# Altium schematic sheet 10  - Latching Delay.SchDoc
size A4
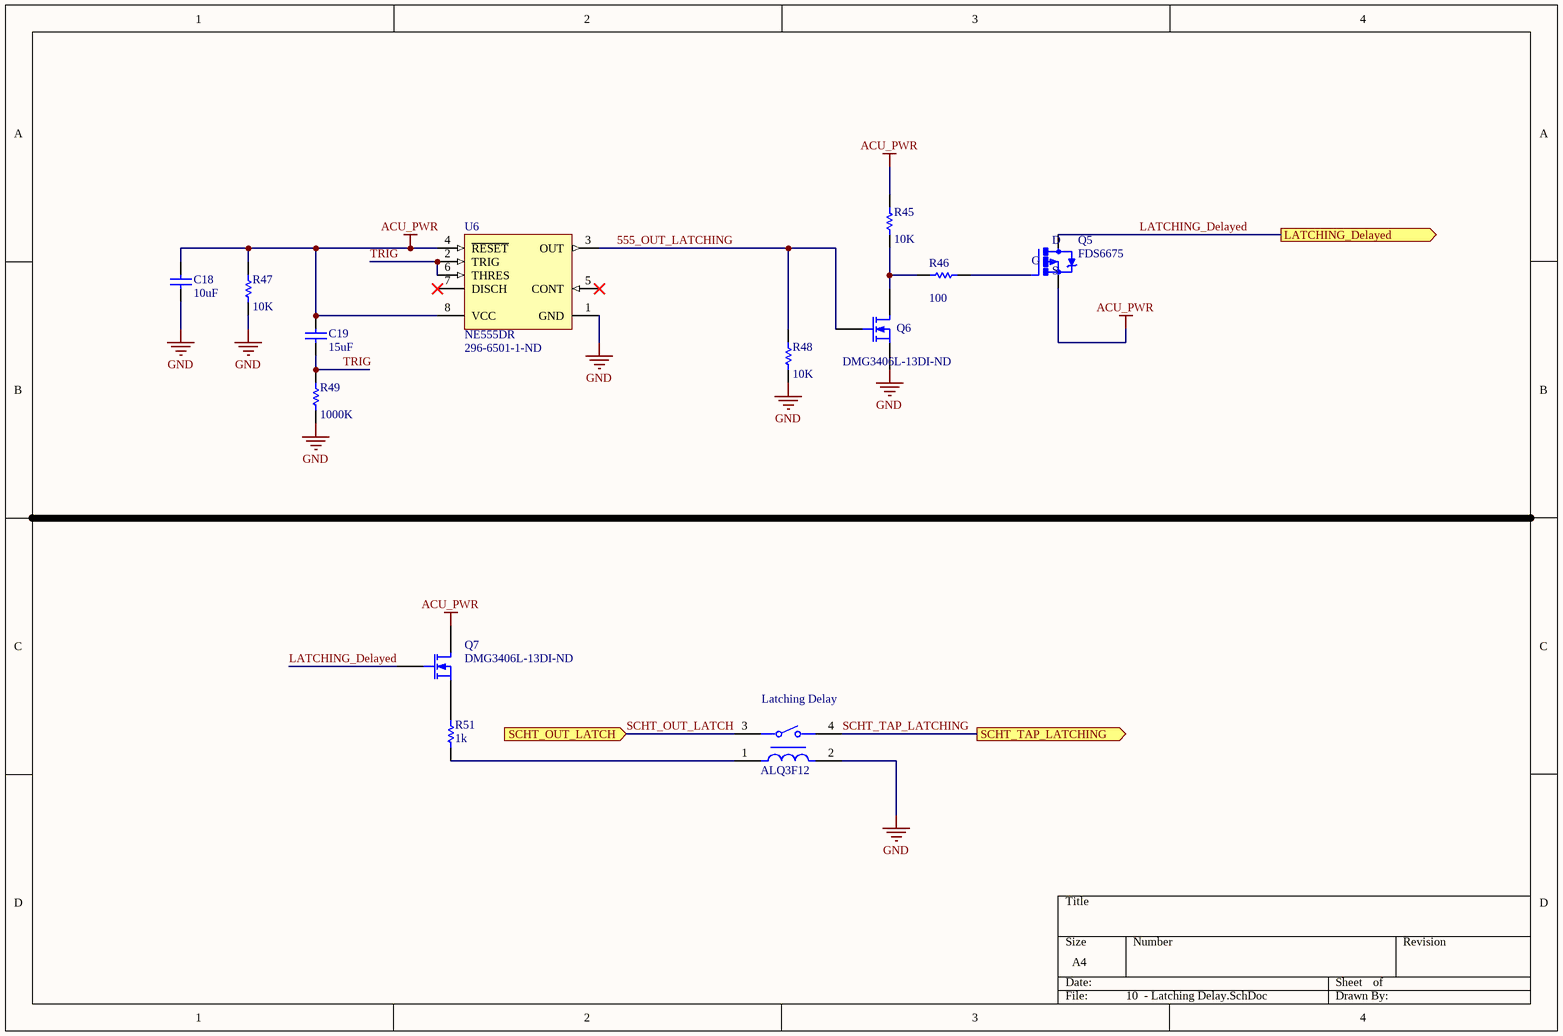
[diagram p0: 10  - Latching Delay.SchDoc]

## Parts
C18  value 10uF  [1608[0603]]  (hidden comment: Cap Semi)
C19  value 15uF  [1608[0603]]  (hidden comment: Cap Semi)
Latching_Delay  ALQ3F12  [FP-ALQ3F12-MFG]
Q5  FDS6675  [SO08-E3]
Q6  Supplier Part Number 1: DMG3406L-13DI-ND  [SOT-23_N]
Q7  Supplier Part Number 1: DMG3406L-13DI-ND  [SOT-23_N]
R45  value 10K  [1608[0603]]  (hidden comment: Res1)
R46  value 100  [1608[0603]]  (hidden comment: Res1)
R47  value 10K  [1608[0603]]
R48  value 10K  [1608[0603]]  (hidden comment: Res1)
R49  value 1000K  [1608[0603]]  (hidden comment: Res1)
R51  value 1k  [1608[0603]]  (hidden comment: Res1)
U6  NE555DR  Supplier Part Number 1: 296-6501-1-ND  [D0008A_M]

## Ports
LATCHING_Delayed (out), SCHT_OUT_LATCH (in), SCHT_TAP_LATCHING (out)

## Nets
ACU_PWR: C18.2 C19.2 Q5.1-3(S) Q7.3(D) R45.2 R47.2 U6.4(~{RESET}) U6.8(VCC)
GND: C18.1 Latching_Delay.2 Q6.2(S) R47.1 R48.1 R49.1 U6.1(GND)
555_OUT_LATCHING: Q6.1(G) R48.2 U6.3(OUT)
LATCHING_Delayed: Q5.5-8(D) Q7.1(G) ; port LATCHING_Delayed
SCHT_OUT_LATCH: Latching_Delay.3 ; port SCHT_OUT_LATCH
SCHT_TAP_LATCHING: Latching_Delay.4 ; port SCHT_TAP_LATCHING
TRIG: C19.1 R49.2 U6.2(TRIG) U6.6(THRES)
NetLatching_Delay_1: Latching_Delay.1 R51.2
NetQ5_4: Q5.4(G) R46.2
NetQ6_3: Q6.3(D) R45.1 R46.1
NetQ7_2: Q7.2(S) R51.1

Not connected (* = marked no-connect by the designer): U6 5(CONT)* 7(DISCH)*

## Library data of the parts
C18 C19 = Cap Semi: Capacitor (Semiconductor SIM Model); Published: 8-Jun-2000; LatestRevisionDate: 29-May-2009; LatestRevisionNote: IPC-7351 Footprint Added.; PackageReference: C1206; Publisher: Altium Limited; PackageDescription: Chip Capacitor; Supplier 1: Digi-Key; Supplier Part Number 1: 490-10991-1-ND
Latching_Delay = CMP-00287-47198074-1: ALQ3F12 ALQ Series SPST 10 A 12 V PC Pin Through Hole Class F Insulation Power Relay; Current Rating: 10A; Coil Voltage (DC): 12V; Relay Type: General Purpose; Number of Contacts: 1; Coil Power: 200mW; Coil Type: Non-Latching; Coil Current: 16.7mA; Coil Resistance: 720Ω; Operate Time: 20ms; Lead Free: Lead Free; Min Operating Temperature: -40°C; Switching Current: 10A; NexarPartId: 47198074; Contact Material: Silver; Max Operating Temperature: 85°C; Ambient Temperature Range High: 85°C; Termination: PC Pin; Height: 16.4mm; Throw Configuration: SPST; Mount: Through Hole; Contact Current Rating: 10A; RoHS: Compliant; Release Time: 20ms
Q5 = FDS6675: P-Channel 30V 11A _Ta_ 2.5W _Ta_ Surface Mount 8-SOIC; MF: ON Semiconductor; MP: FDS6675; Availability: Unavailable; SnapEDA_Link: https://www.snapeda.com/parts/FDS6675/ON%20Semiconductor/view-part/1666192/?ref=snap; Package: SO-8 ON Semiconductor; Value: *; Price: None
Q6 Q7 = MOSFET-N: N-Channel MOSFET; Manufacturer: Infineon Technologies; Manufacturer Part Number: IPD075N03L G; FET Type: MOSFET N-Channel, Metal Oxide; FET Feature: Logic Level Gate; Drain to Source Voltage (Vdss): 30V; Current - Continuous Drain (Id) @ 25°C: 50A (Tc); Rds On (Max) @ Id, Vgs: 7.5 mOhm @ 30A, 10V; Vgs(th) (Max) @ Id: 2.2V @ 250µA; Gate Charge (Qg) @ Vgs: 18nC @ 10V; Input Capacitance (Ciss) @ Vds: 1900pF @ 15V; Power - Max: 47W; Published: 8-Jun-2000; LatestRevisionDate: 17-Jul-2002; LatestRevisionNote: Re-released for DXP Platform.; PackageVersion: 1995/1996; PackageReference: E3; Publisher: Altium Limited; PackageDescription: TO, Flat Index; 3 In-Line, Axial Leads; Body Dia. 4.6mm; Lead Dia. 0.5 mm (max); RoHS: RoHS Compliant; Category: Discrete Semiconductor Products; Packaging: Cut Tape (CT); Mounting Type: Surface Mount; Package / Case: TO-252-3, DPak (2 Leads + Tab), SC-63; Supplier Device Package: PG-TO252-3; ComponentLink1URL: http://www.infineon.com/dgdl/Infineon-IPD075N03LG-DS-v02_01-en.pdf?folderId=5546d4694909da4801490a07012f053b&fileId=db3a30431936bc4b011951d824f83aeb; ComponentLink1Description: http://www.infineon.com/dgdl/Infineon-IPD075N03LG-DS-v02_01-en.pdf?folderId=5546d4694909da4801490a07012f053b&fileId=db3a30431936bc4b011951d824f83aeb; ComponentLink2URL: http://www.semicon.toshiba.co.jp/info/docget.jsp?type=datasheet&lang=en&pid=SSM3K329R; ComponentLink2Description: http://www.semicon.toshiba.co.jp/info/docget.jsp?type=datasheet&lang=en&pid=SSM3K329R; Supplier 1: Digi-Key
R45 R47 R48 = Res1: RES SMD 10K OHM 5% 1/4W 0603; Manufacturer: Rohm Semiconductor; Manufacturer Part Number: ESR03EZPJ103; Power (Watts): 0.25W, 1/4W; Temperature Coefficient: ±200ppm/°C; Published: 8-Jun-2000; LatestRevisionDate: 17-Jul-2002; LatestRevisionNote: Re-released for DXP Platform.; PackageReference: AXIAL-0.3; Publisher: Altium Limited; PackageDescription: Axial Device, Thru-Hole; 2 Leads; 0.3 in Pin Spacing; Supplier 1: Digi-Key; Supplier Part Number 1: RHM10KDCT-ND; RoHS: RoHS Compliant; Category: Resistors; Stock 1: 0; Pricing 1: 1=0.15, 10=0.119, 25=0.0824, 50=0.0642, 100=0.0458, 250=0.03568, 500=0.02836, 1000=0.02012 (CAD); Packaging: Cut Tape (CT); Part Status: Active; Resistance (Ohms): 10k; Tolerance: ±5%; Composition: Thick Film; Features: Automotive AEC-Q200, Pulse Withstanding; Operating Temperature: -55°C ~ 155°C; Package / Case: 0603 (1608 Metric); Supplier Device Package: 0603; Size / Dimension: 0.063" L x 0.031" W (1.60mm x 0.80mm); Height - Seated (Max): 0.022" (0.55mm); Failure Rate: -; ComponentLink1URL: http://rohmfs.rohm.com/en/products/databook/datasheet/passive/resistor/chip_resistor/esr.pdf; ComponentLink1Description: http://rohmfs.rohm.com/en/products/databook/datasheet/passive/resistor/chip_resistor/esr.pdf
R46 = Res1: RES SMD 100 OHM 5% 1/4W 0603; Manufacturer: Rohm Semiconductor; Manufacturer Part Number: ESR03EZPJ101; Power (Watts): 0.25W, 1/4W; Temperature Coefficient: ±200ppm/°C; Published: 8-Jun-2000; LatestRevisionDate: 17-Jul-2002; LatestRevisionNote: Re-released for DXP Platform.; PackageReference: AXIAL-0.3; Publisher: Altium Limited; PackageDescription: Axial Device, Thru-Hole; 2 Leads; 0.3 in Pin Spacing; Supplier 1: Digi-Key; Supplier Part Number 1: RHM100DCT-ND; RoHS: RoHS Compliant; Category: Resistors; Stock 1: 57430; Pricing 1: 1=0.15, 10=0.119, 25=0.0824, 50=0.0642, 100=0.0458, 250=0.03568, 500=0.02836, 1000=0.02012 (CAD); Packaging: Cut Tape (CT); Part Status: Active; Resistance (Ohms): 100; Tolerance: ±5%; Composition: Thick Film; Features: Automotive AEC-Q200, Pulse Withstanding; Operating Temperature: -55°C ~ 155°C; Package / Case: 0603 (1608 Metric); Supplier Device Package: 0603; Size / Dimension: 0.063" L x 0.031" W (1.60mm x 0.80mm); Height - Seated (Max): 0.022" (0.55mm); Failure Rate: -; ComponentLink1URL: http://rohmfs.rohm.com/en/products/databook/datasheet/passive/resistor/chip_resistor/esr.pdf; ComponentLink1Description: http://rohmfs.rohm.com/en/products/databook/datasheet/passive/resistor/chip_resistor/esr.pdf
R49 = Res1: RES SMD 33K OHM 5% 1/4W 0603; Manufacturer: Rohm Semiconductor; Manufacturer Part Number: ESR03EZPJ333; Power (Watts): 0.25W, 1/4W; Temperature Coefficient: ±200ppm/°C; Published: 8-Jun-2000; LatestRevisionDate: 17-Jul-2002; LatestRevisionNote: Re-released for DXP Platform.; PackageReference: AXIAL-0.3; Publisher: Altium Limited; PackageDescription: Axial Device, Thru-Hole; 2 Leads; 0.3 in Pin Spacing; Supplier 1: Digi-Key; Supplier Part Number 1: RHM33KDCT-ND; RoHS: RoHS Compliant; Category: Resistors; Stock 1: 5269; Pricing 1: 1=0.15, 10=0.119, 25=0.0824, 50=0.0642, 100=0.0458, 250=0.03568, 500=0.02836, 1000=0.02012 (CAD); Packaging: Cut Tape (CT); Part Status: Active; Resistance (Ohms): 33k; Tolerance: ±5%; Composition: Thick Film; Features: Automotive AEC-Q200, Pulse Withstanding; Operating Temperature: -55°C ~ 155°C; Package / Case: 0603 (1608 Metric); Supplier Device Package: 0603; Size / Dimension: 0.063" L x 0.031" W (1.60mm x 0.80mm); Height - Seated (Max): 0.022" (0.55mm); Failure Rate: -; ComponentLink1URL: http://rohmfs.rohm.com/en/products/databook/datasheet/passive/resistor/chip_resistor/esr.pdf; ComponentLink1Description: http://rohmfs.rohm.com/en/products/databook/datasheet/passive/resistor/chip_resistor/esr.pdf
R51 = Res1: RES SMD 100 OHM 5% 1/4W 0603; Manufacturer: Rohm Semiconductor; Manufacturer Part Number: ESR03EZPJ101; Resistance (Ohms): 100; Power (Watts): 0.25W, 1/4W; Temperature Coefficient: ±200ppm/°C; Published: 8-Jun-2000; LatestRevisionDate: 17-Jul-2002; LatestRevisionNote: Re-released for DXP Platform.; PackageReference: AXIAL-0.3; Publisher: Altium Limited; PackageDescription: Axial Device, Thru-Hole; 2 Leads; 0.3 in Pin Spacing; Supplier 1: Digi-Key; Supplier Part Number 1: RHM100DCT-ND; RoHS: RoHS Compliant; Category: Resistors; Stock 1: 57430; Pricing 1: 1=0.15, 10=0.119, 25=0.0824, 50=0.0642, 100=0.0458, 250=0.03568, 500=0.02836, 1000=0.02012 (CAD); Packaging: Cut Tape (CT); Part Status: Active; Tolerance: ±5%; Composition: Thick Film; Features: Automotive AEC-Q200, Pulse Withstanding; Operating Temperature: -55°C ~ 155°C; Package / Case: 0603 (1608 Metric); Supplier Device Package: 0603; Size / Dimension: 0.063" L x 0.031" W (1.60mm x 0.80mm); Height - Seated (Max): 0.022" (0.55mm); Failure Rate: -; ComponentLink1URL: http://rohmfs.rohm.com/en/products/databook/datasheet/passive/resistor/chip_resistor/esr.pdf; ComponentLink1Description: http://rohmfs.rohm.com/en/products/databook/datasheet/passive/resistor/chip_resistor/esr.pdf
U6 = CMP-1685-00007-1: Precision Timer, 4.5 to 16 V, 0 to 70 degC, 8-Pin SOIC (D8), Green (RoHS & no Sb/Br), Tape and Reel; Forward Voltage: 450 mV; Forward Current: 1 A; Max Surge Current: 30 A; Peak Reverse Current: 500 uA; Case\Package: SMA; PackageReference: D0008A; Width: 2.84 mm; PackageDescription: 8-Pin Small Outline Integrated Circuit, Body 4.9 x 3.9 mm, Pitch 1.27 mm; DatasheetVersion: SLFS022I, 09/2014; ComponentLink2Description: Datasheet; Package Quantity: 1; REACH SVHC: Unknown; Radiation Hardening: No; Height: 2.44 mm; Code_JEDEC: MS-012; Pins: 2; ComponentLink1Description: Manufacturer URL; ComponentLink3Description: Package Specification; ComponentLink3URL: http://www.ti.com/lit/ml/msoi002j/msoi002j.pdf; Length: 4.57 mm; ComponentLink1URL: http://www.ti.com/; Mount: Surface Mount; PackageVersion: 4040047-3/M, 06/2011; ComponentLink2URL: http://www.ti.com/general/docs/lit/getliterature.tsp?genericPartNumber=NE555&fileType=pdf; RoHSCompliant: true; Max Operating Temperature: 125 degC; Packaging: Cut Tape; Min Operating Temperature: -55 degC; Supplier 1: Digi-Key